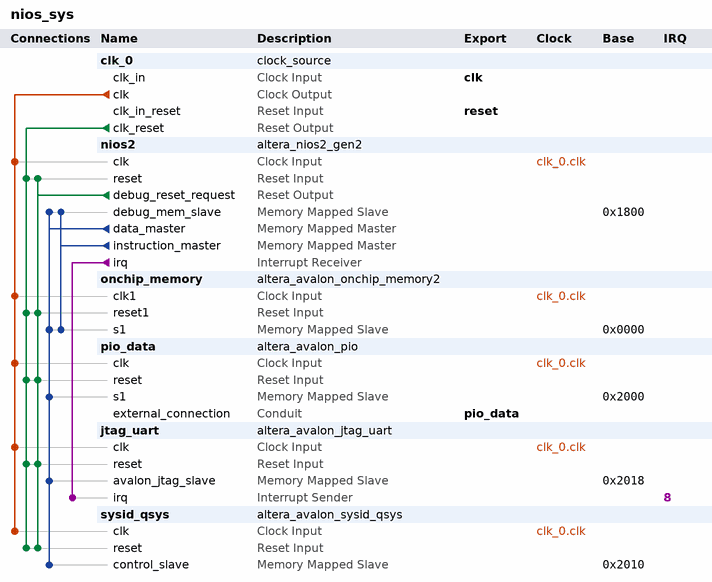
[diagram p0: system contents]
# Platform Designer (Qsys) system nios_sys, MAX 10 10M08SAU169C8G
# Parameters at their usual value, and those the tool derives, are not listed.
package require -exact qsys 18.1
create_system nios_sys
set_project_property DEVICE_FAMILY {MAX 10}
set_project_property DEVICE 10M08SAU169C8G

add_instance clk_0 clock_source 18.1
set_instance_parameter_value clk_0 clockFrequency 50000000

add_instance nios2 altera_nios2_gen2 18.1
set_instance_parameter_value nios2 dcache_size 2048
set_instance_parameter_value nios2 exceptionSlave onchip_memory.s1
set_instance_parameter_value nios2 icache_size 4096
set_instance_parameter_value nios2 impl Fast
set_instance_parameter_value nios2 resetSlave onchip_memory.s1

add_instance onchip_memory altera_avalon_onchip_memory2 18.1
set_instance_parameter_value onchip_memory dataWidth 32
set_instance_parameter_value onchip_memory dualPort false
set_instance_parameter_value onchip_memory initMemContent true
set_instance_parameter_value onchip_memory initializationFileName onchip_mem.hex
set_instance_parameter_value onchip_memory memorySize 4096

add_instance pio_data altera_avalon_pio 18.1
set_instance_parameter_value pio_data direction Output
set_instance_parameter_value pio_data width 4

add_instance jtag_uart altera_avalon_jtag_uart 18.1
set_instance_parameter_value jtag_uart simInteractiveOptions NO_INTERACTIVE_WINDOWS

add_instance sysid_qsys altera_avalon_sysid_qsys 18.1
set_instance_parameter_value sysid_qsys id 4112

# connections
add_connection clk_0.clk jtag_uart.clk clock
add_connection clk_0.clk nios2.clk clock
add_connection clk_0.clk onchip_memory.clk1 clock
add_connection clk_0.clk pio_data.clk clock
add_connection clk_0.clk sysid_qsys.clk clock
add_connection clk_0.clk_reset jtag_uart.reset reset
add_connection clk_0.clk_reset nios2.reset reset
add_connection clk_0.clk_reset onchip_memory.reset1 reset
add_connection clk_0.clk_reset pio_data.reset reset
add_connection clk_0.clk_reset sysid_qsys.reset reset
add_connection nios2.debug_reset_request jtag_uart.reset reset
add_connection nios2.debug_reset_request nios2.reset reset
add_connection nios2.debug_reset_request onchip_memory.reset1 reset
add_connection nios2.debug_reset_request pio_data.reset reset
add_connection nios2.debug_reset_request sysid_qsys.reset reset
add_connection nios2.data_master jtag_uart.avalon_jtag_slave avalon
set_connection_parameter_value nios2.data_master/jtag_uart.avalon_jtag_slave baseAddress 0x2018
add_connection nios2.data_master nios2.debug_mem_slave avalon
set_connection_parameter_value nios2.data_master/nios2.debug_mem_slave baseAddress 0x1800
add_connection nios2.data_master onchip_memory.s1 avalon
set_connection_parameter_value nios2.data_master/onchip_memory.s1 baseAddress 0x0000
add_connection nios2.data_master pio_data.s1 avalon
set_connection_parameter_value nios2.data_master/pio_data.s1 baseAddress 0x2000
add_connection nios2.data_master sysid_qsys.control_slave avalon
set_connection_parameter_value nios2.data_master/sysid_qsys.control_slave baseAddress 0x2010
add_connection nios2.instruction_master nios2.debug_mem_slave avalon
set_connection_parameter_value nios2.instruction_master/nios2.debug_mem_slave baseAddress 0x1800
add_connection nios2.instruction_master onchip_memory.s1 avalon
set_connection_parameter_value nios2.instruction_master/onchip_memory.s1 baseAddress 0x0000
add_connection nios2.irq jtag_uart.irq interrupt
set_connection_parameter_value nios2.irq/jtag_uart.irq irqNumber 8

# exported interfaces
add_interface clk clock sink
set_interface_property clk EXPORT_OF clk_0.clk_in
add_interface pio_data conduit end
set_interface_property pio_data EXPORT_OF pio_data.external_connection
add_interface reset reset sink
set_interface_property reset EXPORT_OF clk_0.clk_in_reset

set_interconnect_requirement {$system} qsys_mm.clockCrossingAdapter HANDSHAKE
set_interconnect_requirement {$system} qsys_mm.enableEccProtection FALSE
set_interconnect_requirement {$system} qsys_mm.insertDefaultSlave FALSE
set_interconnect_requirement {$system} qsys_mm.maxAdditionalLatency 1

save_system nios_sys.qsys
